# EAGLE design uJOVE_BleedFix (EAGLE 9.4.2)

## Sheet 1 of 2
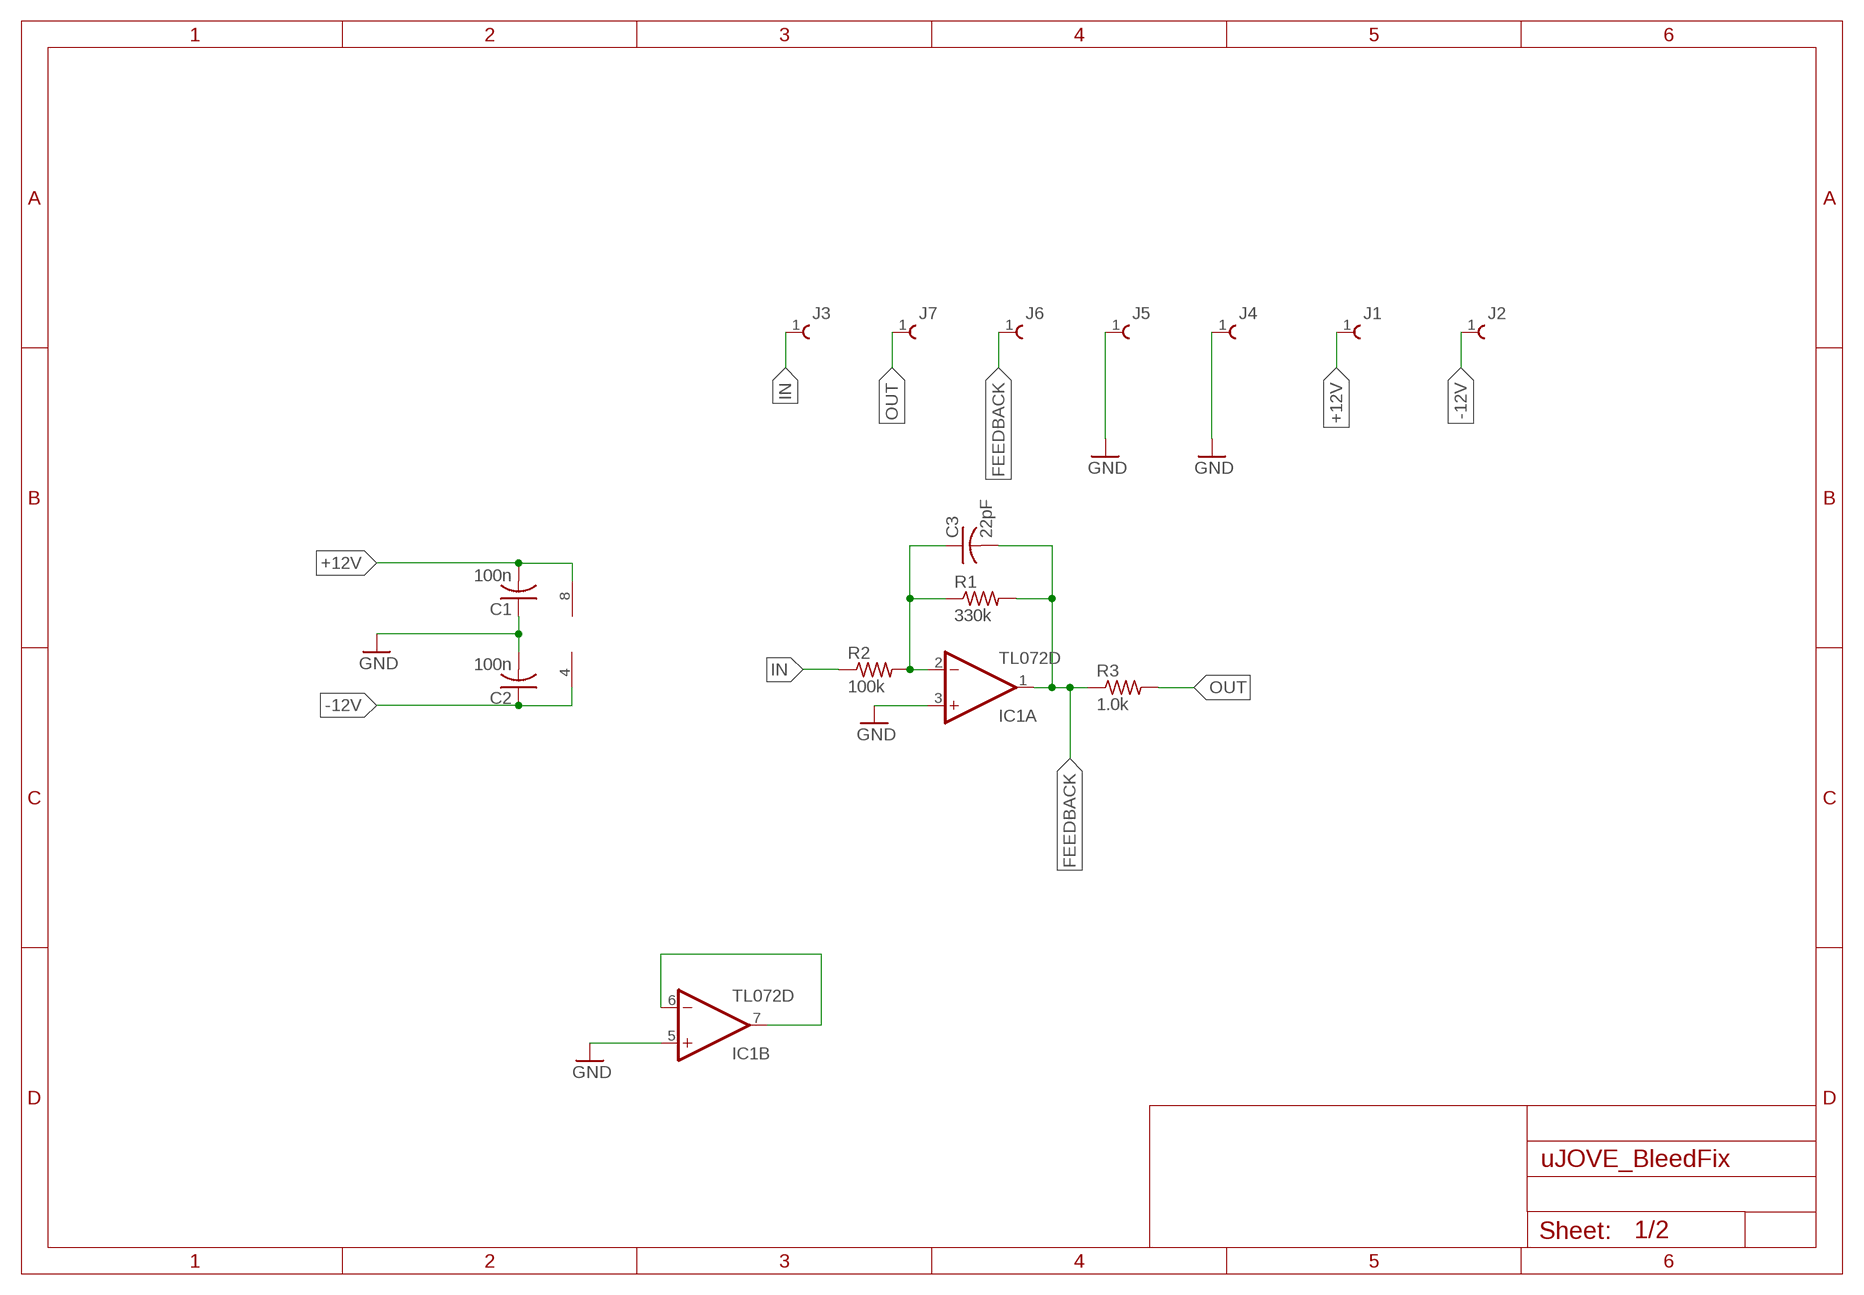
[diagram p0: schematic, sheet 1]

### Parts
C1  100n  C-USC0603  [C0603]
C2  100n  C-USC0603  [C0603]
C3  22pF  C-USC0603  [C0603]
IC1  TL072D  [SO08]
J1  61300111121  [61300111121]
J2  61300111121  [61300111121]
J3  61300111121  [61300111121]
J4  61300111121  [61300111121]
J5  61300111121  [61300111121]
J6  61300111121  [61300111121]
J7  61300111121  [61300111121]
R1  330k  R-US_R0603  [R0603]
R2  100k  R-US_R0603  [R0603]
R3  1.0k  R-US_R0603  [R0603]

### Nets
+12V: C1.2 IC1.8(P:V+) J1.1
-12V: C2.1 IC1.4(P:V-) J2.1
FEEDBACK: C3.2 IC1.1(A:OUT) J6.1 R1.2 R3.1
GND: C1.1 C2.2 IC1.3(A:+IN) IC1.5(B:+IN) J4.1 J5.1
IN: J3.1 R2.1
N$1: IC1.6(B:-IN) IC1.7(B:OUT)
N$2: C3.1 IC1.2(A:-IN) R1.1 R2.2
OUT: J7.1 R3.2

## Sheet 2 of 2

## Library data of the parts
C1-C3 = resistor:C-US: CAPACITOR, American symbol
IC1 = linear:TL072: OP AMP
J1-J7 = Wurth_Elektronik_Electromechanic_Board_to_Board_Connectors_rev18b:61300111121: WR-PHD 2.54 mm Pin Header, 1Pin=>Code : Con_BTB_PHD_2.54_1_THT_61300111121 <http://katalog.we-online.de/media/images/eican/Con_BTB_PHD_2.54_1_THT_6130xx11121_pf2.jpg> Details see: http://katalog.we-online.de/en/em/613_0xx_111_21 Created 2014-05-29, Karrer Zheng 2014 (C) Würth Elektronik
R1-R3 = rcl:R-US_: RESISTOR, American symbol; SPICEPREFIX: R

## Board
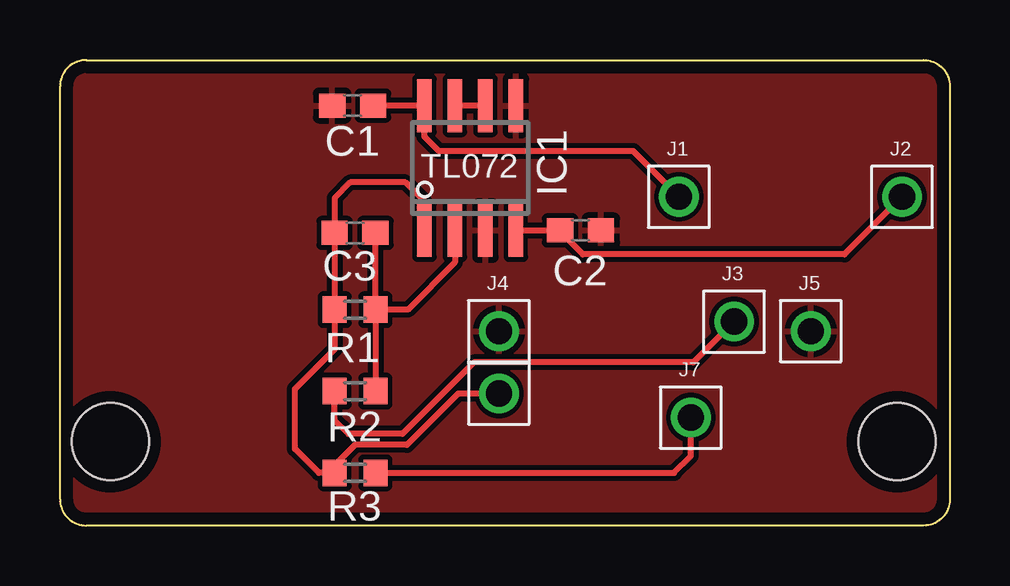
[diagram p1: board, top side]
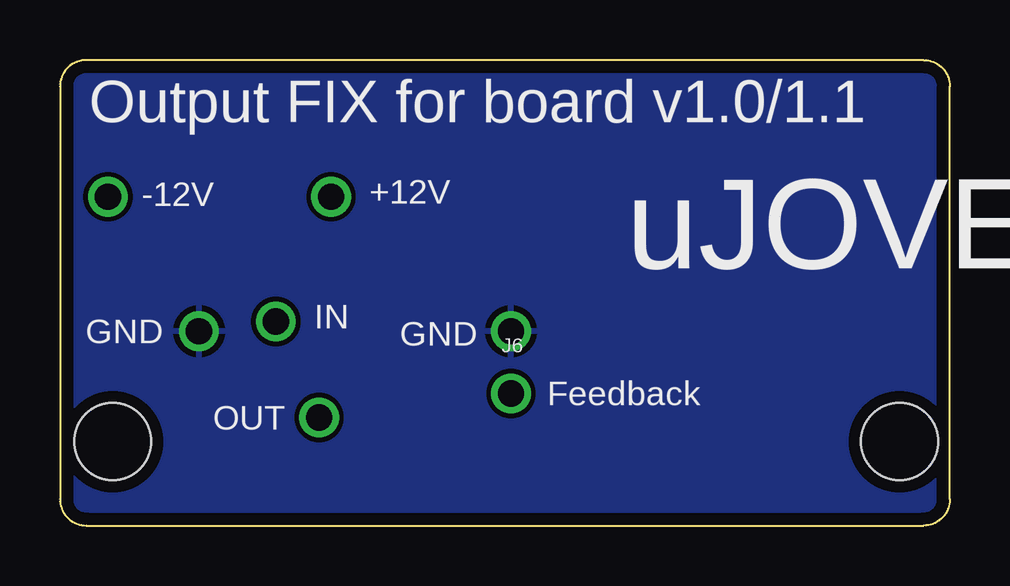
[diagram p2: board, bottom side, seen from below]

Size 37.1 x 19.4 mm. Coordinates in mm from the lower left corner, seen from the top.
Outline: 37.1,18.3 37.1,1.1 arc-90 36,0 1.1,0 arc-90 0,1.1 0,18.3 arc-90 1.1,19.4 36,19.4 arc-90 37.1,18.3
Copper layers (1*16): Top 0.035mm / dielectric 1.5mm / Bottom 0.035mm
Design rules "default *": minimum track width 10mil, minimum drill 0.4mm, track to track 8mil, track to pad 6mil, pad to pad 6mil, via to via 6mil, smd to smd 6mil, copper to edge 20mil, drill to drill 6mil, minimum pad ring 10mil, minimum via ring 8mil, stop-mask expansion 4mil, vias tented up to drill 25mil, thermal gap 10mil
Holes 3.2 mm at 2.1,3.5 34.9,3.5

### Footprints (pad centres in the part's own frame; a part is rotated, then mirrored left to right if it is on the bottom)
C0603 = smd 1.1 x 1: 1 -0.85,0; 2 0.85,0
SO08 = smd 0.6 x 2.2: 1 -1.905,-2.6; 2 -0.635,-2.6; 3 0.635,-2.6; 4 1.905,-2.6; 5 1.905,2.6; 6 0.635,2.6; 7 -0.635,2.6; 8 -1.905,2.6
61300111121 = drill 1.1: 1 0,0
R0603 = smd 1 x 1.1: 1 -0.85,0; 2 0.85,0

### Placement (x,y rotation side)
C1  12.2,17.5 0 top
C2  21.7,12.3 0 top
C3  12.3,12.2 180 top
IC1  17.1,14.9 0 top
J1  25.8,13.7 0 top
J2  35.1,13.7 0 top
J3  28.1,8.5 0 top
J4  18.3,8.1 0 top
J5  31.3,8.1 0 top
J6  18.3,5.5 0 top
J7  26.3,4.5 0 top
R1  12.3,9 180 top
R2  12.3,5.6 0 top
R3  12.3,2.2 0 top

### Tracks (layer width: path | path; a pad name or v marks a point on that pad's centre or on a via)
+12V
  Top 0.254: C1.2 IC1.8 15.19,16.2 15.8,15.6 23.9,15.6 J1.1
-12V
  Top 0.254: IC1.4 20.8,12.3 | 20.8,12.3 C2.1 | J2.1 32.7,11.3 21.8,11.3 20.8,12.3
FEEDBACK
  Top 0.254: IC1.1 15.19,13.5 14.4,14.3 12.1,14.3 11.45,13.65 C3.2 R1.2 11.45,7.35 9.8,5.7 9.8,3.2 10.8,2.2 R3.1 11.45,2.52 12.3,3.37 14.47,3.37 16.6,5.5 J6.1
GND
  pour Top: -0.1,0 -0.1,19.5 1.6,19.5 37.2,19.5 37.2,17.1 37.2,-0.1 35.8,-0.1 -0.1,-0.1
  pour Bottom: -0.1,0 -0.1,19.5 1.6,19.5 37.2,19.5 37.2,17.1 37.2,-0.1 35.8,-0.1 -0.1,-0.1
IN
  Top 0.254: J3.1 26.4,6.8 17.25,6.8 14.28,3.82 12.03,3.82 11.45,4.4 R2.1
N$1
  Top 0.254: IC1.6 IC1.7
N$2
  Top 0.254: IC1.2 16.46,10.96 14.5,9 R1.1 | R1.1 C3.1 | R1.1 R2.2
OUT
  Top 0.254: R3.2 25.6,2.2 26.3,2.9 J7.1

### Text on the board
tPlace: TL072
bPlace: Output FIX for board v1.0/1.1 | +12V | -12V | uJOVE | GND | GND | IN | Feedback | OUT